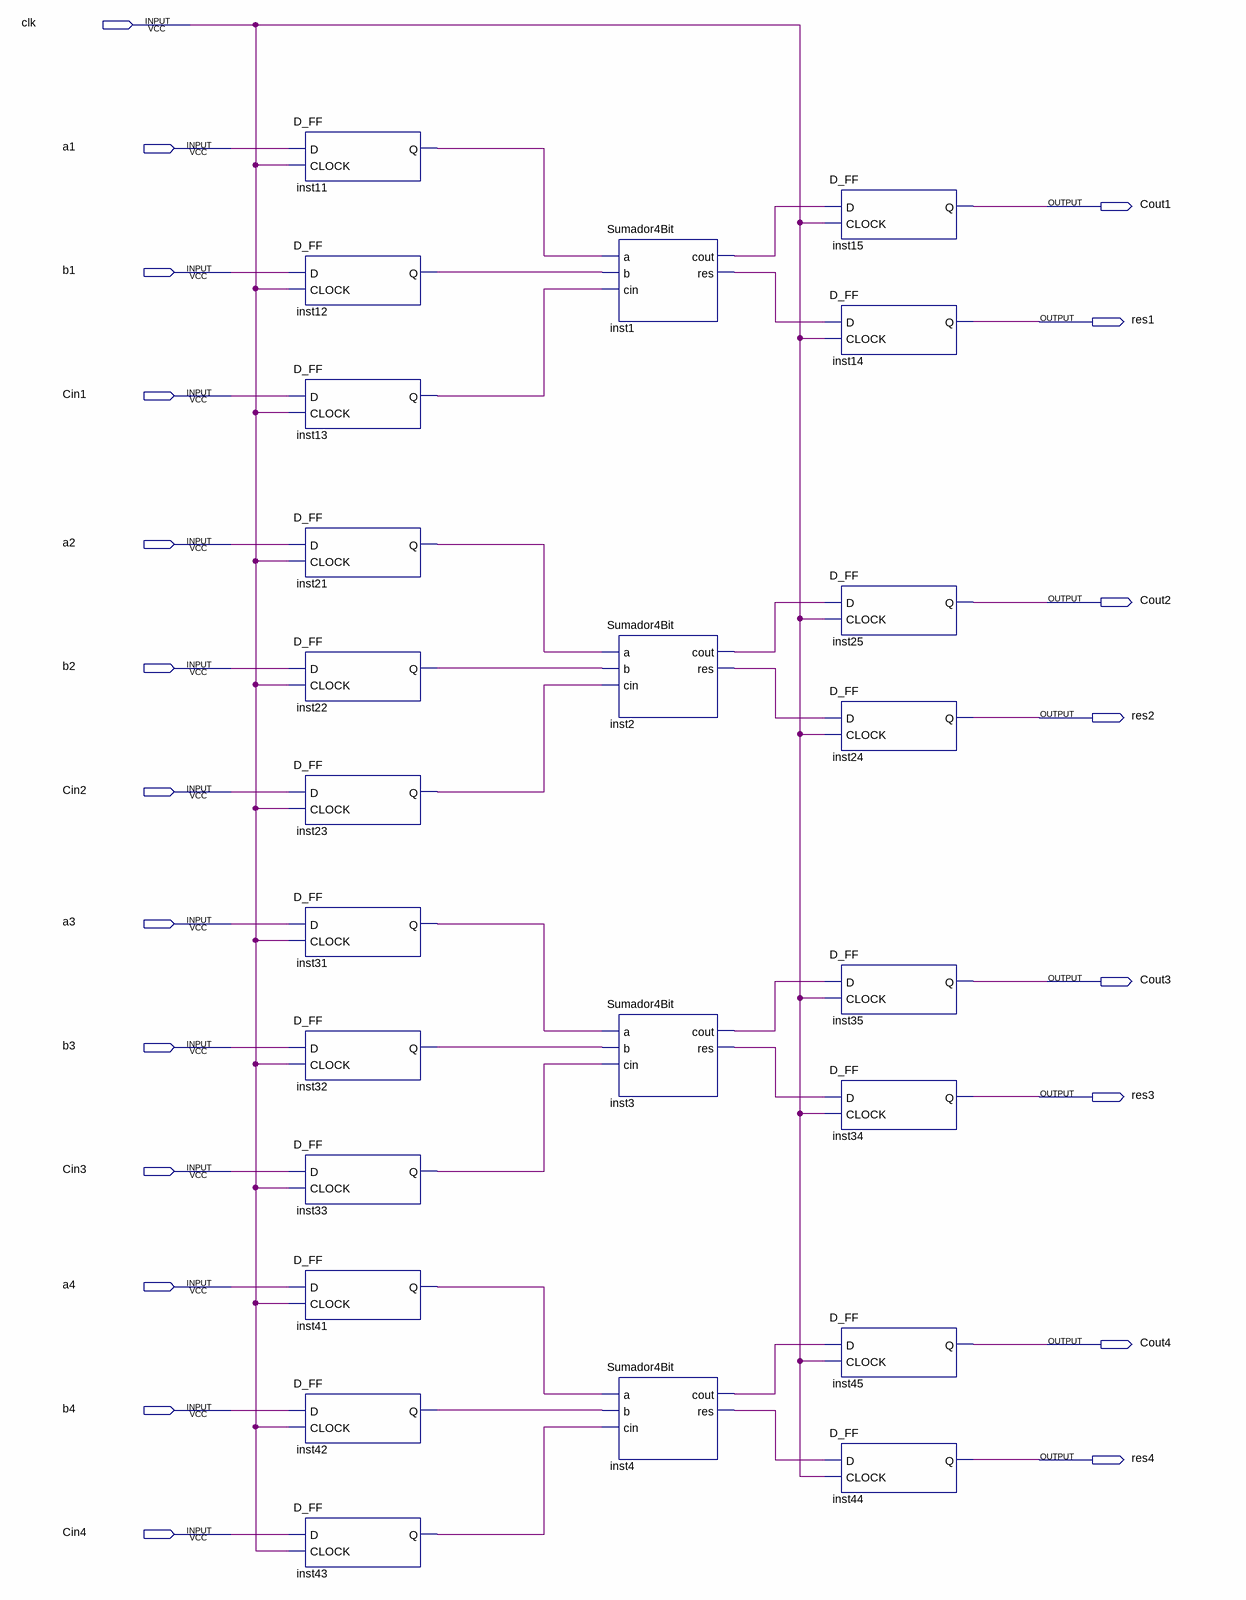
[diagram p0: schematic sheet]
// Quartus schematic Block1.bdf as structural Verilog: 24 symbols, 21 pins
module Block1 (
  input  clk,
  input  a1,
  input  b1,
  input  Cin1,
  input  a2,
  input  b2,
  input  Cin2,
  input  a3,
  input  b3,
  input  Cin3,
  input  a4,
  input  b4,
  input  Cin4,
  output Cout1,
  output res1,
  output Cout2,
  output res2,
  output Cout3,
  output res3,
  output Cout4,
  output res4
);

  wire inst1_cout, inst1_res, inst2_cout, inst2_res, inst3_cout, inst3_res, inst4_cout, inst4_res, inst11_q,
       inst12_q, inst13_q, inst21_q, inst22_q, inst23_q, inst31_q, inst32_q, inst33_q, inst41_q, inst42_q,
       inst43_q;

  D_FF inst11 (.D(a1), .CLOCK(clk), .Q(inst11_q));
  D_FF inst12 (.D(b1), .CLOCK(clk), .Q(inst12_q));
  D_FF inst13 (.D(Cin1), .CLOCK(clk), .Q(inst13_q));
  D_FF inst21 (.D(a2), .CLOCK(clk), .Q(inst21_q));
  D_FF inst22 (.D(b2), .CLOCK(clk), .Q(inst22_q));
  D_FF inst23 (.D(Cin2), .CLOCK(clk), .Q(inst23_q));
  D_FF inst31 (.D(a3), .CLOCK(clk), .Q(inst31_q));
  D_FF inst32 (.D(b3), .CLOCK(clk), .Q(inst32_q));
  D_FF inst33 (.D(Cin3), .CLOCK(clk), .Q(inst33_q));
  D_FF inst41 (.D(a4), .CLOCK(clk), .Q(inst41_q));
  D_FF inst42 (.D(b4), .CLOCK(clk), .Q(inst42_q));
  D_FF inst43 (.D(Cin4), .CLOCK(clk), .Q(inst43_q));
  Sumador4Bit inst1 (.a(inst11_q), .b(inst12_q), .cin(inst13_q), .cout(inst1_cout), .res(inst1_res));
  Sumador4Bit inst2 (.a(inst21_q), .b(inst22_q), .cin(inst23_q), .cout(inst2_cout), .res(inst2_res));
  Sumador4Bit inst3 (.a(inst31_q), .b(inst32_q), .cin(inst33_q), .cout(inst3_cout), .res(inst3_res));
  Sumador4Bit inst4 (.a(inst41_q), .b(inst42_q), .cin(inst43_q), .cout(inst4_cout), .res(inst4_res));
  D_FF inst15 (.D(inst1_cout), .CLOCK(clk), .Q(Cout1));
  D_FF inst14 (.D(inst1_res), .CLOCK(clk), .Q(res1));
  D_FF inst25 (.D(inst2_cout), .CLOCK(clk), .Q(Cout2));
  D_FF inst24 (.D(inst2_res), .CLOCK(clk), .Q(res2));
  D_FF inst35 (.D(inst3_cout), .CLOCK(clk), .Q(Cout3));
  D_FF inst34 (.D(inst3_res), .CLOCK(clk), .Q(res3));
  D_FF inst45 (.D(inst4_cout), .CLOCK(clk), .Q(Cout4));
  D_FF inst44 (.D(inst4_res), .CLOCK(clk), .Q(res4));
endmodule
